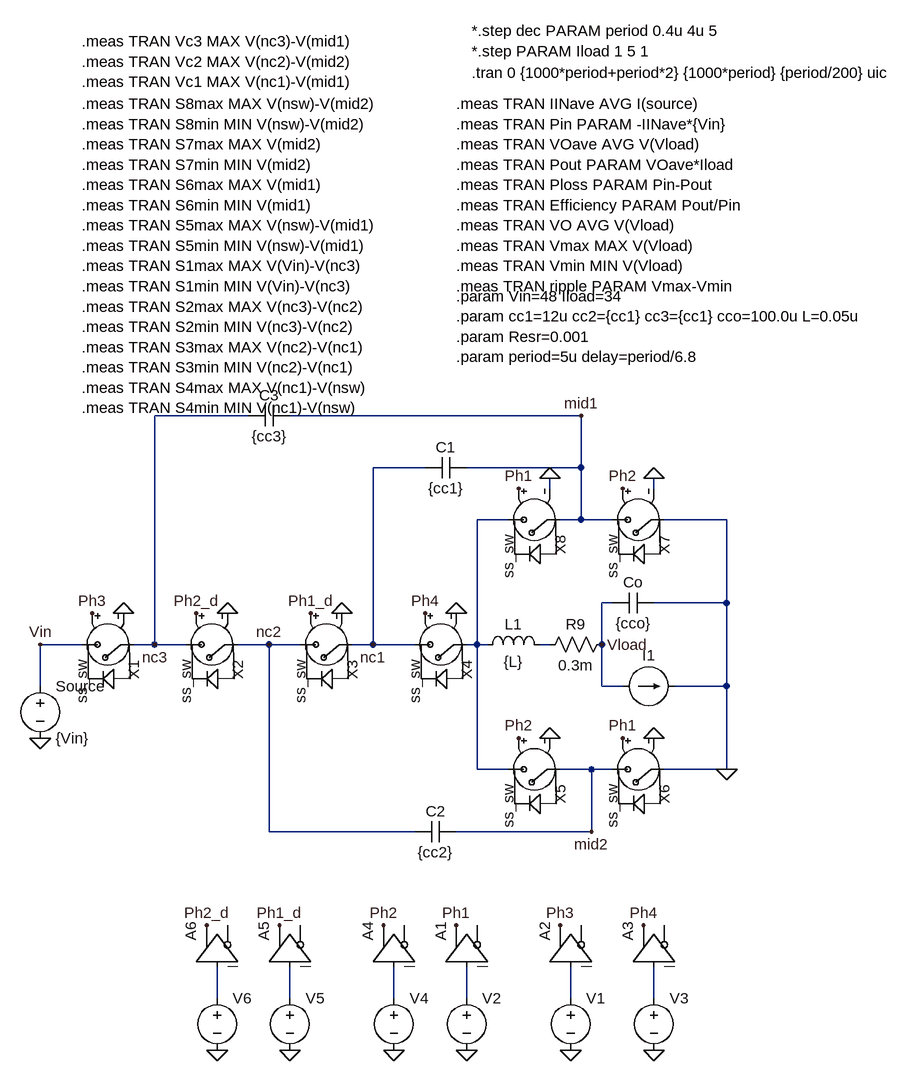
[diagram p0: schematic 4to1_dickson_split_phase_48V.asc]
4to1_dickson_split_phase_48V.asc, the LTspice schematic file:
Version 4
SHEET 1 1904 1156
WIRE -64 -272 -208 -272
WIRE 448 -272 0 -272
WIRE 208 -192 128 -192
WIRE 448 -192 448 -272
WIRE 448 -192 272 -192
WIRE 400 -160 400 -176
WIRE 560 -160 560 -176
WIRE 336 -112 288 -112
WIRE 448 -112 448 -192
WIRE 448 -112 416 -112
WIRE 496 -112 448 -112
WIRE 672 -112 576 -112
WIRE 496 16 480 16
WIRE 672 16 672 -112
WIRE 672 16 560 16
WIRE -320 80 -384 80
WIRE -208 80 -208 -272
WIRE -208 80 -240 80
WIRE -160 80 -208 80
WIRE -32 80 -80 80
WIRE 16 80 -32 80
WIRE 128 80 128 -192
WIRE 128 80 96 80
WIRE 192 80 128 80
WIRE 288 80 288 -112
WIRE 288 80 272 80
WIRE 304 80 288 80
WIRE 400 80 384 80
WIRE 480 80 480 16
WIRE -384 144 -384 80
WIRE 480 144 480 80
WIRE 512 144 480 144
WIRE 672 144 672 16
WIRE 672 144 592 144
WIRE 288 272 288 80
WIRE 336 272 288 272
WIRE 464 272 416 272
WIRE 496 272 464 272
WIRE 672 272 672 144
WIRE 672 272 576 272
WIRE -32 368 -32 80
WIRE 192 368 -32 368
WIRE 464 368 464 272
WIRE 464 368 256 368
WIRE -112 624 -112 576
WIRE 0 624 0 576
WIRE 160 624 160 576
WIRE 272 624 272 576
WIRE 432 624 432 576
WIRE 560 624 560 576
FLAG 272 704 0
FLAG 256 512 Ph1
FLAG -384 224 0
FLAG -304 32 Ph3
FLAG 32 32 Ph1_d
FLAG 352 -160 Ph1
FLAG 512 224 Ph1
FLAG -144 32 Ph2_d
FLAG 208 32 Ph4
FLAG 512 -160 Ph2
FLAG 352 224 Ph2
FLAG -256 32 0
FLAG -96 32 0
FLAG 80 32 0
FLAG 256 32 0
FLAG 400 -176 0
FLAG 400 224 0
FLAG 560 -176 0
FLAG 560 224 0
FLAG -384 80 Vin
FLAG 480 80 Vload
FLAG 672 272 0
FLAG 144 512 Ph2
FLAG 432 704 0
FLAG 416 512 Ph3
FLAG 560 704 0
FLAG 544 512 Ph4
FLAG 160 704 0
FLAG 448 -272 mid1
FLAG 464 368 mid2
FLAG -208 80 nc3
FLAG -32 80 nc2
FLAG 128 80 nc1
FLAG 0 704 0
FLAG -16 512 Ph1_d
FLAG -128 512 Ph2_d
FLAG -112 704 0
SYMBOL voltage 272 608 R0
WINDOW 123 0 0 Left 2
WINDOW 39 0 0 Left 2
WINDOW 3 24 96 Invisible 2
SYMATTR Value PULSE(0 1 0 1n 1n {period/2-1n} {period})
SYMATTR InstName V2
SYMBOL buf 208 576 R270
SYMATTR InstName A1
SYMBOL voltage -384 128 R0
WINDOW 123 0 0 Left 2
WINDOW 39 0 0 Left 2
SYMATTR InstName Source
SYMATTR Value {Vin}
SYMBOL cap -64 -256 R270
WINDOW 0 32 32 VTop 2
WINDOW 3 0 32 VBottom 2
SYMATTR InstName C3
SYMATTR Value {cc3}
SYMATTR SpiceLine V={Vin/4*3} Rser={Resr}
SYMBOL cap 208 -176 R270
WINDOW 0 32 32 VTop 2
WINDOW 3 0 32 VBottom 2
SYMATTR InstName C1
SYMATTR Value {cc1}
SYMATTR SpiceLine V={Vin/4*1} Rser={Resr}
SYMBOL cap 192 384 R270
WINDOW 0 32 32 VTop 2
WINDOW 3 0 32 VBottom 2
SYMATTR InstName C2
SYMATTR Value {cc2}
SYMATTR SpiceLine V={Vin/4*2} Rser={Resr}
SYMBOL cap 496 32 R270
WINDOW 0 32 32 VTop 2
WINDOW 3 0 32 VBottom 2
SYMATTR InstName Co
SYMATTR Value {cco}
SYMATTR SpiceLine Rser={Resr}
SYMBOL current 512 144 R270
WINDOW 0 32 40 VTop 2
WINDOW 3 -32 40 Invisible 2
WINDOW 123 0 0 Left 2
WINDOW 39 0 0 Left 2
SYMATTR InstName I1
SYMATTR Value PULSE(0 {Iload} {period*50} {period*500} 0 1 2 1)
SYMBOL ind 288 96 R270
WINDOW 0 32 56 VTop 2
WINDOW 3 5 56 VBottom 2
SYMATTR InstName L1
SYMATTR Value {L}
SYMATTR SpiceLine Rser=0
SYMBOL res 496 64 R90
WINDOW 0 0 56 VBottom 2
WINDOW 3 32 56 VTop 2
SYMATTR InstName R9
SYMATTR Value 0.3m
SYMBOL voltage 432 608 R0
WINDOW 123 0 0 Left 2
WINDOW 39 0 0 Left 2
WINDOW 3 24 96 Invisible 2
SYMATTR Value PULSE(0 1 0 1n 1n {period/2-delay} {period})
SYMATTR InstName V1
SYMBOL buf 368 576 R270
SYMATTR InstName A2
SYMBOL voltage 560 608 R0
WINDOW 123 0 0 Left 2
WINDOW 39 0 0 Left 2
WINDOW 3 24 96 Invisible 2
SYMATTR Value PULSE(0 1 {period/2} 1n 1n {period/2-delay} {period})
SYMATTR InstName V3
SYMBOL buf 496 576 R270
SYMATTR InstName A3
SYMBOL voltage 160 608 R0
WINDOW 123 0 0 Left 2
WINDOW 39 0 0 Left 2
WINDOW 3 24 96 Invisible 2
SYMATTR Value PULSE(0 1 {period/2} 1n 1n {period/2-1n} {period})
SYMATTR InstName V4
SYMBOL buf 96 576 R270
SYMATTR InstName A4
SYMBOL voltage 0 608 R0
WINDOW 123 0 0 Left 2
WINDOW 39 0 0 Left 2
WINDOW 3 24 96 Invisible 2
SYMATTR Value PULSE(0 1 0 1n 1n {period/2-10n} {period})
SYMATTR InstName V5
SYMBOL buf -64 576 R270
SYMATTR InstName A5
SYMBOL voltage -112 608 R0
WINDOW 123 0 0 Left 2
WINDOW 39 0 0 Left 2
WINDOW 3 24 96 Invisible 2
SYMATTR Value PULSE(0 1 {period/2} 1n 1n {period/2-10n} {period})
SYMATTR InstName V6
SYMBOL buf -176 576 R270
SYMATTR InstName A6
SYMBOL ss_sw -224 80 R90
SYMATTR InstName X1
SYMATTR SpiceLine ron = 1.1m
SYMBOL ss_sw -64 80 R90
SYMATTR InstName X2
SYMATTR SpiceLine ron = 1.1m
SYMBOL ss_sw 112 80 R90
SYMATTR InstName X3
SYMATTR SpiceLine ron = 1.1m
SYMBOL ss_sw 288 80 R90
SYMATTR InstName X4
SYMATTR SpiceLine ron = 1.1m
SYMBOL ss_sw 432 272 R90
SYMATTR InstName X5
SYMATTR SpiceLine ron = 0.7m
SYMBOL ss_sw 592 272 R90
SYMATTR InstName X6
SYMATTR SpiceLine ron = 0.7m
SYMBOL ss_sw 592 -112 R90
SYMATTR InstName X7
SYMATTR SpiceLine ron = 0.35m
SYMBOL ss_sw 432 -112 R90
SYMATTR InstName X8
SYMATTR SpiceLine ron = 0.35m
TEXT 280 -800 Left 2 !.tran 0 {1000*period+period*2} {1000*period} {period/200} uic
TEXT 256 -752 Left 2 !.meas TRAN IINave AVG I(source)\n.meas TRAN Pin PARAM -IINave*{Vin}\n.meas TRAN VOave AVG V(Vload)\n.meas TRAN Pout PARAM VOave*Iload\n.meas TRAN Ploss PARAM Pin-Pout\n.meas TRAN Efficiency PARAM Pout/Pin\n.meas TRAN VO AVG V(Vload)\n.meas TRAN Vmax MAX V(Vload)\n.meas TRAN Vmin MIN V(Vload)\n.meas TRAN ripple PARAM Vmax-Vmin
TEXT 256 -456 Left 2 !.param Vin=48 Iload=34\n.param cc1=12u cc2={cc1} cc3={cc1} cco=100.0u L=0.05u\n.param Resr=0.001\n.param period=5u delay=period/6.8
TEXT 280 -864 Left 2 !*.step dec PARAM period 0.4u 4u 5\n*.step PARAM Iload 1 5 1
TEXT -320 -848 Left 2 !.meas TRAN Vc3 MAX V(nc3)-V(mid1)\n.meas TRAN Vc2 MAX V(nc2)-V(mid2)\n.meas TRAN Vc1 MAX V(nc1)-V(mid1)
TEXT -320 -752 Left 2 !.meas TRAN S8max MAX V(nsw)-V(mid2)\n.meas TRAN S8min MIN V(nsw)-V(mid2)\n.meas TRAN S7max MAX V(mid2)\n.meas TRAN S7min MIN V(mid2)\n.meas TRAN S6max MAX V(mid1)\n.meas TRAN S6min MIN V(mid1)\n.meas TRAN S5max MAX V(nsw)-V(mid1)\n.meas TRAN S5min MIN V(nsw)-V(mid1)\n.meas TRAN S1max MAX V(Vin)-V(nc3)\n.meas TRAN S1min MIN V(Vin)-V(nc3)\n.meas TRAN S2max MAX V(nc3)-V(nc2)\n.meas TRAN S2min MIN V(nc3)-V(nc2)\n.meas TRAN S3max MAX V(nc2)-V(nc1)\n.meas TRAN S3min MIN V(nc2)-V(nc1)\n.meas TRAN S4max MAX V(nc1)-V(nsw)\n.meas TRAN S4min MIN V(nc1)-V(nsw)

The netlist it stands for:
* 4to1_dickson_split_phase_48V.asc
V2 N006 0 PULSE(0 1 0 1n 1n {period/2-1n} {period})
A1 N006 0 0 0 0 0 Ph1 0 BUF
V§Source Vin 0 {Vin}
C3 nc3 mid1 {cc3} V={Vin/4*3} Rser={Resr}
C1 nc1 mid1 {cc1} V={Vin/4*1} Rser={Resr}
C2 nc2 mid2 {cc2} V={Vin/4*2} Rser={Resr}
Co Vload 0 {cco} Rser={Resr}
I1 Vload 0 PULSE(0 {Iload} {period*50} {period*500} 0 1 2 1)
L1 N001 N002 {L} Rser=0
R9 Vload N002 0.3m
V1 N007 0 PULSE(0 1 0 1n 1n {period/2-delay} {period})
A2 N007 0 0 0 0 0 Ph3 0 BUF
V3 N008 0 PULSE(0 1 {period/2} 1n 1n {period/2-delay} {period})
A3 N008 0 0 0 0 0 Ph4 0 BUF
V4 N005 0 PULSE(0 1 {period/2} 1n 1n {period/2-1n} {period})
A4 N005 0 0 0 0 0 Ph2 0 BUF
V5 N004 0 PULSE(0 1 0 1n 1n {period/2-10n} {period})
A5 N004 0 0 0 0 0 Ph1_d 0 BUF
V6 N003 0 PULSE(0 1 {period/2} 1n 1n {period/2-10n} {period})
A6 N003 0 0 0 0 0 Ph2_d 0 BUF
XX1 nc3 Vin Ph3 0 ss_sw ron = 1.1m  ; pins A B NC+ NC-
XX2 nc2 nc3 Ph2_d 0 ss_sw ron = 1.1m  ; pins A B NC+ NC-
XX3 nc1 nc2 Ph1_d 0 ss_sw ron = 1.1m  ; pins A B NC+ NC-
XX4 N001 nc1 Ph4 0 ss_sw ron = 1.1m  ; pins A B NC+ NC-
XX5 mid2 N001 Ph2 0 ss_sw ron = 0.7m  ; pins A B NC+ NC-
XX6 0 mid2 Ph1 0 ss_sw ron = 0.7m  ; pins A B NC+ NC-
XX7 0 mid1 Ph2 0 ss_sw ron = 0.35m  ; pins A B NC+ NC-
XX8 mid1 N001 Ph1 0 ss_sw ron = 0.35m  ; pins A B NC+ NC-
.tran 0 {1000*period+period*2} {1000*period} {period/200} uic
.meas TRAN IINave AVG I(source)
.meas TRAN Pin PARAM -IINave*{Vin}
.meas TRAN VOave AVG V(Vload)
.meas TRAN Pout PARAM VOave*Iload
.meas TRAN Ploss PARAM Pin-Pout
.meas TRAN Efficiency PARAM Pout/Pin
.meas TRAN VO AVG V(Vload)
.meas TRAN Vmax MAX V(Vload)
.meas TRAN Vmin MIN V(Vload)
.meas TRAN ripple PARAM Vmax-Vmin
.param Vin=48 Iload=34
.param cc1=12u cc2={cc1} cc3={cc1} cco=100.0u L=0.05u
.param Resr=0.001
.param period=5u delay=period/6.8
*.step dec PARAM period 0.4u 4u 5
*.step PARAM Iload 1 5 1
.meas TRAN Vc3 MAX V(nc3)-V(mid1)
.meas TRAN Vc2 MAX V(nc2)-V(mid2)
.meas TRAN Vc1 MAX V(nc1)-V(mid1)
.meas TRAN S8max MAX V(nsw)-V(mid2)
.meas TRAN S8min MIN V(nsw)-V(mid2)
.meas TRAN S7max MAX V(mid2)
.meas TRAN S7min MIN V(mid2)
.meas TRAN S6max MAX V(mid1)
.meas TRAN S6min MIN V(mid1)
.meas TRAN S5max MAX V(nsw)-V(mid1)
.meas TRAN S5min MIN V(nsw)-V(mid1)
.meas TRAN S1max MAX V(Vin)-V(nc3)
.meas TRAN S1min MIN V(Vin)-V(nc3)
.meas TRAN S2max MAX V(nc3)-V(nc2)
.meas TRAN S2min MIN V(nc3)-V(nc2)
.meas TRAN S3max MAX V(nc2)-V(nc1)
.meas TRAN S3min MIN V(nc2)-V(nc1)
.meas TRAN S4max MAX V(nc1)-V(nsw)
.meas TRAN S4min MIN V(nc1)-V(nsw)
.backanno
.end